# EAGLE schematic Regensensor (EAGLE 7.7.0)
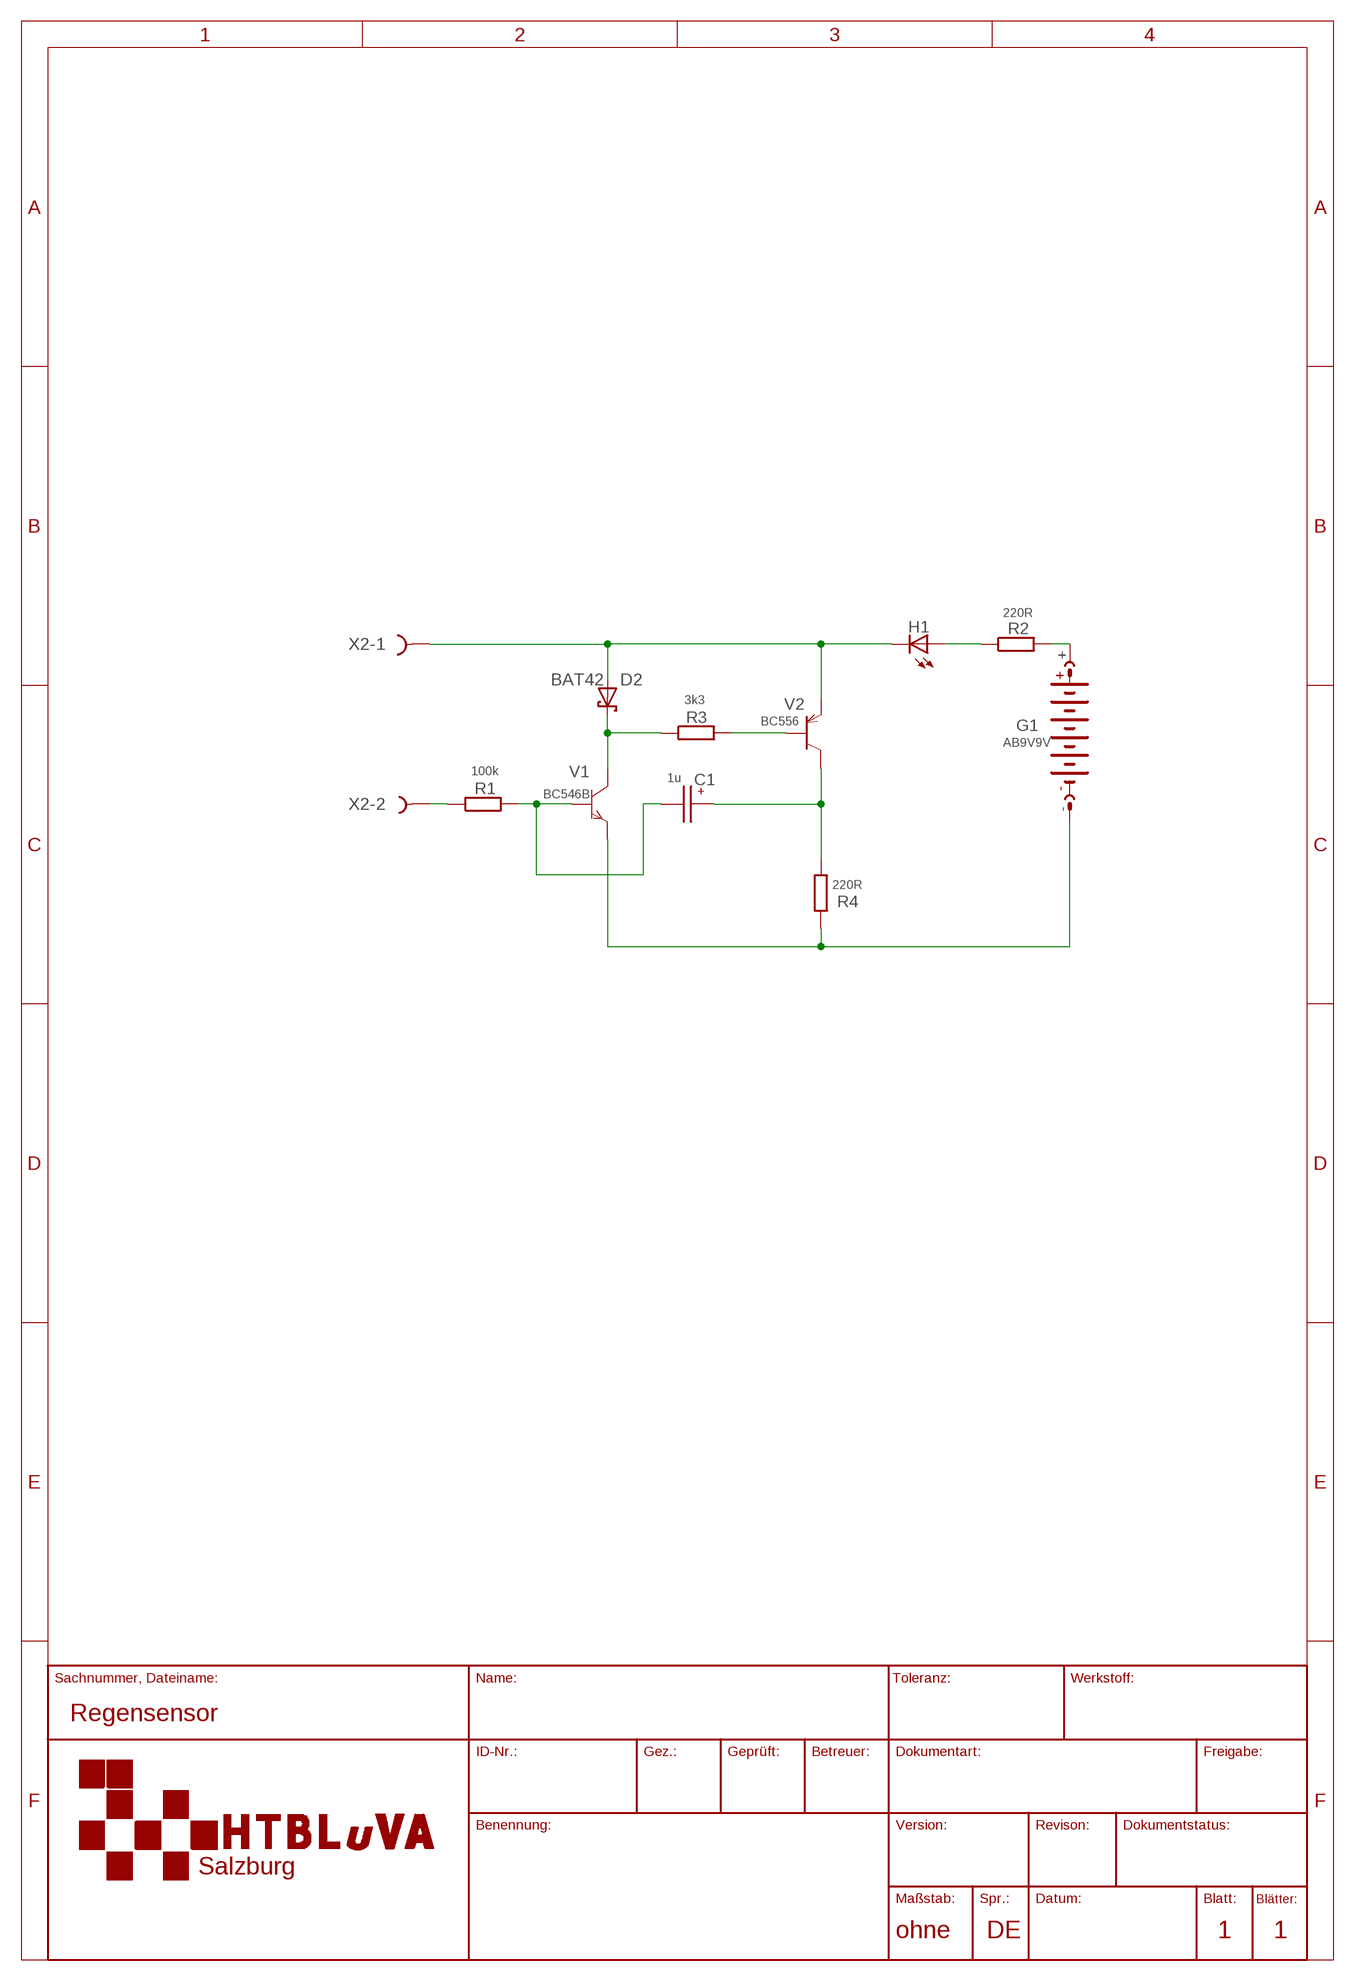
[diagram p0: schematic, sheet 1]

## Parts
C1  1u  CPOL-V_E2-5  [E2-5]
D2  BAT42  [DO35-10]
G1  AB9V9V  [AB9V]
H1  LED_3MM  [LED3MM]
R1  100k  R-H_0309/12  [0309/12]
R2  220R  R-H_0309/12  [0309/12]
R3  3k3  R-H_0309/12  [0309/12]
R4  220R  R-H_0309/12  [0309/12]
V1  BC546B  [TO92-EBC]
V2  BC556  [TO92-EBC]
X2  W237-02P  [W237-132]

## Nets
GND: G1.- R4.2 V1.E
N$1: G1.+ R2.2
N$2: D2.A H1.K(C) V2.E X2.1
N$3: C1.+ R4.1 V2.C
N$4: D2.C R3.1 V1.C
N$6: C1.- R1.2 V1.B
N$7: R1.1 X2.2
N$8: H1.A R2.1
N$9: R3.2 V2.B

## Library data of the parts
C1 = rcl_TicA:CPOL-V_: POLARIZED CAPACITOR, European symbol
D2 = diode:BAT42: DIODE barrier diode
G1 = Battery_TicA:AB9V: 9-V BATTERY CLIP
H1 = led_TicA:LED_: LED OSRAM: - CHIPLED LG R971, LG N971, LY N971, LG Q971, LY Q971, LO R971, LY R971 LH N974, LH R974 LS Q976, LO Q976, LY Q976 LO Q996 - Hyper CHIPLED LW Q18S LB Q993, LB Q99A, LB R99A - SideLED LS A670, LO A670, LY A670, LG A670, LP A670 LB A673, LV A673, LT A673, LW A673 LH A674 LY A675 LS A676, LA A676, LO A676, LY A676, LW A676 LS A679, LY A679, LG A679 - Hyper Micro SIDELED® LS Y876, LA Y876, LO Y876, LY Y876 LT Y87S - SmartLED LW L88C, LW L88S LB L89C, LB L89S, LG L890 LS L89K, LO L89K, LY L89K LS L896, LA L896, LO L896, LY L896 - TOPLED LS T670, LO T670, LY T670, LG T670, LP T670 LSG T670, LSP T670, LSY T670, LOP T670, LYG T670 LG T671, LOG T671, LSG T671 LB T673, LV T673, LT T673, LW T673 LH T674 LS T676, LA T676, LO T676, LY T676, LB T676, LH T676, LSB T676, LW T676 LB T67C, LV T67C, LT T67C, LS T67K, LO T67K, LY T67K, LW E67C LS E67B, LA E67B, LO E67B, LY E67B, LB E67C, LV E67C, LT E67C LW T67C LS T679, LY T679, LG T679 LS T770, LO T770, LY T770, LG T770, LP T770 LB T773, LV T773, LT T773, LW T773 LH T774 LS E675, LA E675, LY E675, LS T675 LS T776, LA T776, LO T776, LY T776, LB T776 LHGB T686 LT T68C, LB T68C - Hyper Mini TOPLED® LB M676 - Mini TOPLED Santana® LG M470 LS M47K, LO M47K, LY M47K Source: http://www.osram.convergy.de LUXEON: - LUMILED® LXK2-PW12-R00, LXK2-PW12-S00, LXK2-PW14-U00, LXK2-PW14-V00 LXK2-PM12-R00, LXK2-PM12-S00, LXK2-PM14-U00 LXK2-PE12-Q00, LXK2-PE12-R00, LXK2-PE12-S00, LXK2-PE14-T00, LXK2-PE14-U00 LXK2-PB12-K00, LXK2-PB12-L00, LXK2-PB12-M00, LXK2-PB14-N00, LXK2-PB14-P00, LXK2-PB14-Q00 LXK2-PR12-L00, LXK2-PR12-M00, LXK2-PR14-Q00, LXK2-PR14-R00 LXK2-PD12-Q00, LXK2-PD12-R00, LXK2-PD12-S00 LXK2-PH12-R00, LXK2-PH12-S00 LXK2-PL12-P00, LXK2-PL12-Q00, LXK2-PL12-R00 Source: www.luxeon.com KINGBRIGHT: KA-3528ASYC Source: www.kingbright.com
R1-R4 = rcl_TicA:R-H_: RESISTOR, European symbol
V1 = transistor_TicA:BC546*: NPN Transistor
V2 = transistor_TicA:BC556*: PNP Transistror
X2 = con_TicA:W237-02P: WAGO SREW CLAMP; OC_FARNELL: unknown; OC_NEWARK: unknown